# Altium schematic sheet BOOST_CONVERTER.SchDoc
size A; SheetNumber: 21; SheetTotal: 31
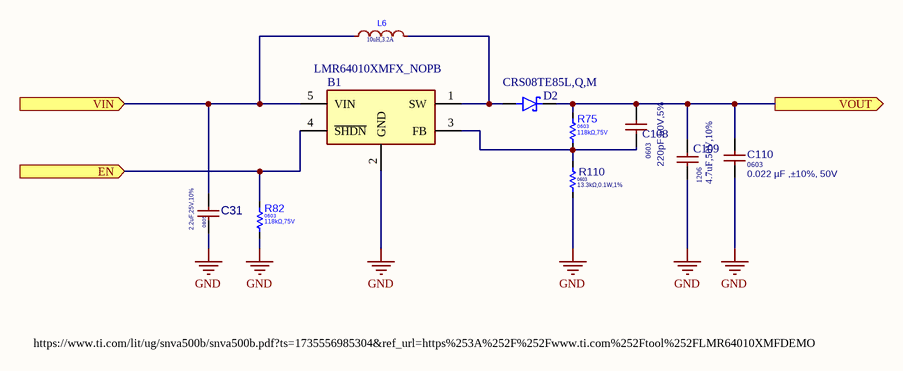
[diagram p0: BOOST_CONVERTER.SchDoc]

## Parts
B1  LMR64010XMFX_NOPB  [SOT95P280X145-5N]
C31  Package: 0805  [C0805]  (hidden comment: 2.2uF,25V,10%)
C108  value 220pF,50V,5%  Package: 0603  [C0603]  (hidden comment: 220pF)
C109  value 4.7uF,50V,10%  Package: 1206  [C1206]  (hidden comment: 4.7uF)
C110  value 0.022 µF ,±10%, 50V  Package: 0603  [C0603]  (hidden comment: 0.022 µF)
D2  CRS08TE85L,Q,M  [S-FLAT_TOS]
L6  value 10uH,3.2A  [inductor_SMD,5.2x5.4mm]  (hidden comment: 10uH)
R75  value 118kΩ,75V  Package: 0603  [R0603]  (hidden comment: 118kΩ)
R82  value 118kΩ,75V  Package: 0603  [R0603]  (hidden comment: 118kΩ)
R110  value 13.3kΩ,0.1W,1%  Package: 0603  [R0603]  (hidden comment: 13.3K)

## Ports
EN (in), VIN (in), VOUT (out)

## Nets
GND: B1.2(GND) C31.1 C109.1 C110.1 R82.2 R110.1
EN: B1.4(~{SHDN}) R82.1 ; port EN
VIN: B1.5(VIN) C31.2 L6.1 ; port VIN
VOUT: C108.2 C109.2 C110.2 D2.2(K) R75.1 ; port VOUT
NetB1_1: B1.1(SW) D2.1(A) L6.2
NetB1_3: B1.3(FB) C108.1 R75.2 R110.2

## Notes on the sheet
- https://www.ti.com/lit/ug/snva500b/snva500b.pdf?ts=1735556985304&ref_url=https%253A%252F%252Fwww.ti.com%252Ftool%252FLMR64010XMFDEMO

## Library data of the parts
B1 = LMR64010XMFX_NOPB: SIMPLE SWITCHER 2.7V to 14V, 1A Step-Up Regulator in SOT-23 Package; Manufacturer_Name: Texas Instruments; Manufacturer_Part_Number: LMR64010XMFX/NOPB; Geometry.Height: 1.45mm; Mouser Part Number: 926-LMR64010XMFXNOPB; Mouser Price/Stock: https://www.mouser.co.uk/ProductDetail/Texas-Instruments/LMR64010XMFX-NOPB?qs=51W%2FvVdgODjFVfZsQmPpyA%3D%3D; Datasheet Link: http://www.ti.com/lit/gpn/lmr64010
C31 = CAP_Template_0805: CAP CER 2.2UF 25V X7R 10% 0805; Manufacturer: Samsung; MPN: CL21B225KAFNNNE; Type: SM; Max Operating Temp: 105; Min Operating Temp: -55; Datasheet: https://datasheet.lcsc.com/lcsc/2304140030_Samsung-Electro-Mechanics-CL21B225KAFNNNE_C19110.pdf; LCSC: C19110; Value: 2.2uF,25V,10%
C108 = C0603C221J5GACTU: 220 pF ±5% 50V Ceramic Capacitor C0G, NP0 0603 (1608 Metric); Manufacturer: KEMET; Type: *; MPN: C0603C221J5GACTU; Min Operating Temp: -55; Datasheet: https://search.kemet.com/download/datasheet/C0603C221J5GAC7867; Max Operating Temp: +125; LCSC: C452747
C109 = GRM32ER71H475KA88L: 4.7 µF ±10% 50V Ceramic Capacitor X7R 1210 (3225 Metric); Manufacturer: Murata Electronics; Datasheet: https://search.murata.co.jp/Ceramy/image/img/A01X/G101/ENG/GRM32ER71H475KA88-01.pdf; LCSC: C86052; MPN: GRM32ER71H475KA88L
C110 = GRM188R71H223KA01D: 0.022 µF ±10% 50V Ceramic Capacitor X7R 0603 (1608 Metric); Manufacturer: Murata Electronics; Type: *; MPN: GRM188R71H223KA01D; Min Operating Temp: -55; Datasheet: https://search.murata.co.jp/Ceramy/image/img/A01X/G101/ENG/GRM188R71H223KA01-01.pdf; Max Operating Temp: +125; LCSC: C77056
D2 = CRS08TE85L,Q,M: DIODE SCHOTTKY 30V 1.5A S-FLAT; Mfr_Name: Toshiba Electronic Devices & Storage Corp.; MPN: CRS08(TE85L,Q,M); value: 30 V,1.5A
L6 = FXL0530-100-M: 3.2A 10uH Integrated molded inductor ±20% 3.5A SMD,5.2x5.4mm Power Inductors ROHS; Manufacturer: cjiang; LCSC: C177248; MPN: FXL0530-100-M; Package: SMD,5.2x5.4mm; Datasheet: https://atta.szlcsc.com/upload/public/pdf/source/20240426/3189EA8206330E2108542F9E34E540E7.pdf
R75 R82 = 0603WAF1183T5E: 100mW Thick Film Resistors 75V ±100ppm/℃ ±1% 118kΩ 0603 Chip Resistor - Surface Mount ROHS; Manufacturer: UNI-ROYAL; LCSC: C25806; MPN: 0603WAF1183T5E; Datasheet: https://atta.szlcsc.com/upload/public/pdf/source/20200306/C422600_1E6D84923E4A46A82E41ADD87F860B5C.pdf; Operating Temperature Range: -55℃~+155℃
R110 = CRCW060313K3FKEA: 13.3 kOhms ±1% 0.1W, 1/10W Chip Resistor 0603 (1608 Metric) Automotive AEC-Q200 Thick Film; Manufacturer: Vishay Dale; Type: *; Min Operating Temp: -55; MPN: CRCW060313K3FKEA; Datasheet: https://www.vishay.com/docs/20035/dcrcwe3.pdf; Max Operating Temp: +155; LCSC: C844126